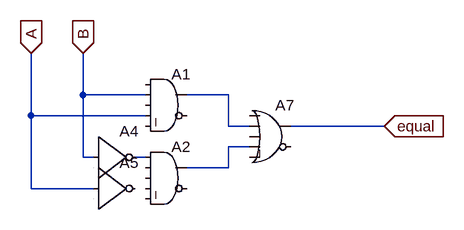
[diagram p0: schematic equal_comp.asc]
equal_comp.asc, the LTspice schematic file:
Version 4
SHEET 1 880 680
WIRE 80 96 80 32
WIRE 176 96 80 96
WIRE 304 96 240 96
WIRE 0 128 0 32
WIRE 176 128 0 128
WIRE 304 144 304 96
WIRE 336 144 304 144
WIRE 544 144 400 144
WIRE 336 176 304 176
WIRE 80 192 80 96
WIRE 96 192 80 192
WIRE 176 192 160 192
WIRE 304 208 304 176
WIRE 304 208 240 208
WIRE 0 240 0 128
WIRE 96 240 0 240
FLAG 0 32 A
IOPIN 0 32 In
FLAG 80 32 B
IOPIN 80 32 In
FLAG 544 144 equal
IOPIN 544 144 In
SYMBOL Digital\\and 208 48 R0
SYMATTR InstName A1
SYMBOL Digital\\and 208 160 R0
SYMATTR InstName A2
SYMBOL Digital\\inv 96 128 R0
SYMATTR InstName A4
SYMBOL Digital\\inv 96 176 R0
SYMATTR InstName A5
SYMBOL Digital\\or 368 96 R0
SYMATTR InstName A7

The netlist it stands for:
* equal_comp.asc
A1 0 B 0 A 0 0 N001 0 AND
A2 N003 0 0 0 0 0 N002 0 AND
A4 B 0 0 0 0 N003 0 0 BUF
A5 A 0 0 0 0 0 0 0 BUF
A7 0 N001 0 N002 0 0 equal 0 OR
.backanno
.end